# EAGLE design EventCounter (EAGLE 9.0.1)
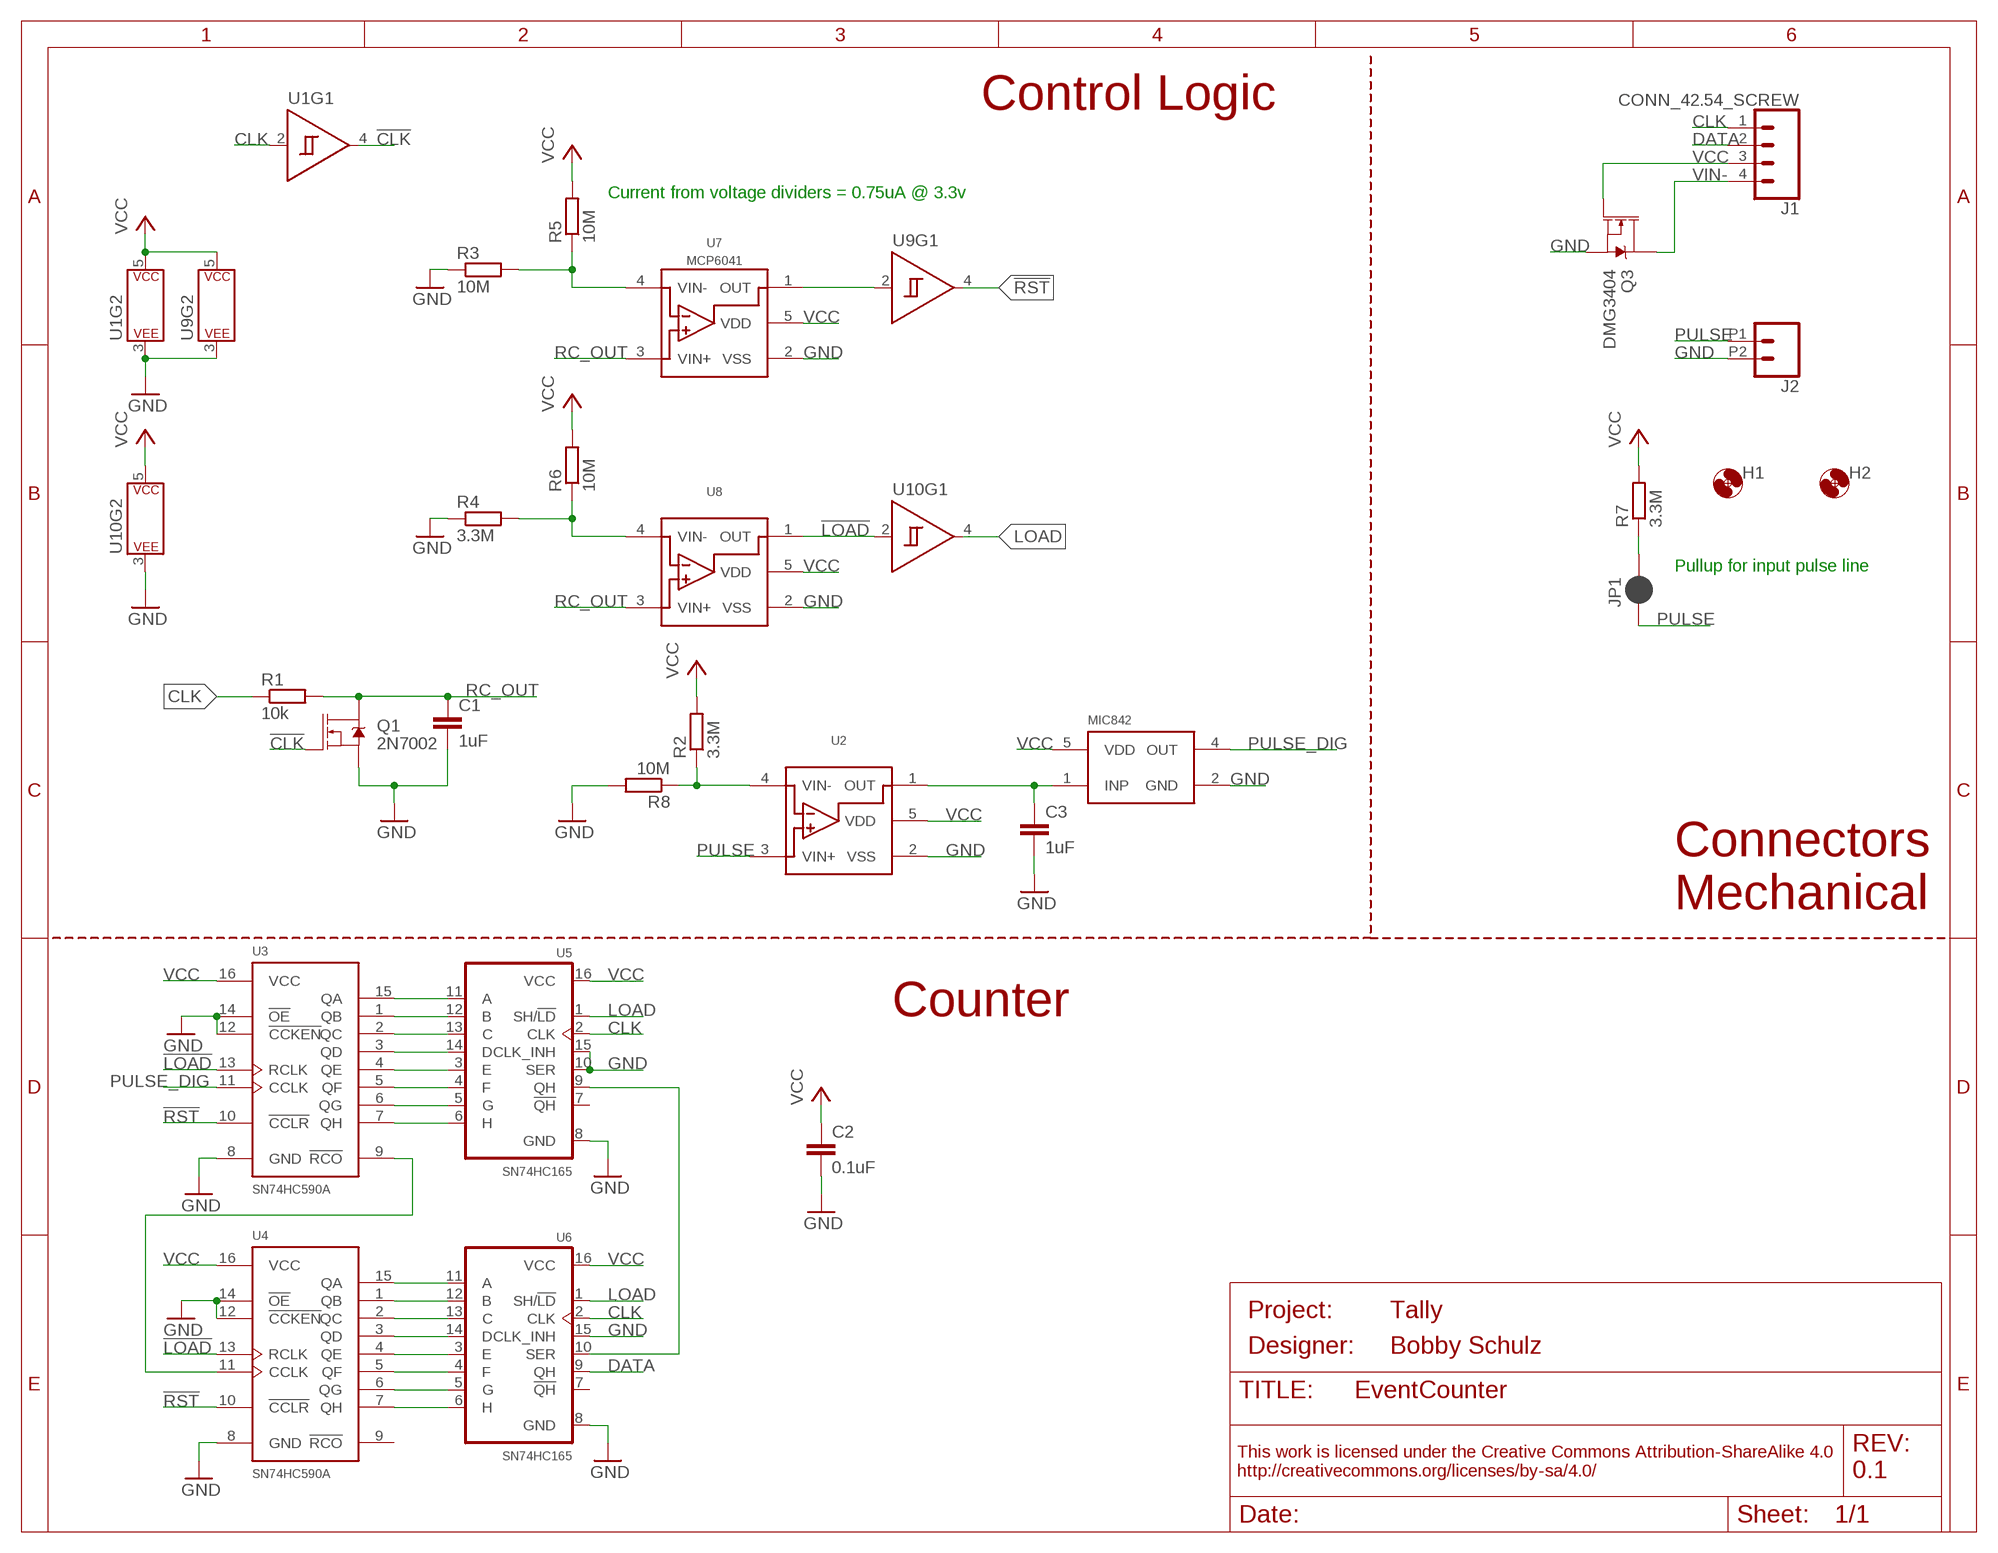
[diagram p0: schematic, sheet 1]
FRAME1 (FRAME_A_L): DESIGNER: Bobby Schulz; PROJECT: Tally; REV: 0.1

## Parts
C1  1uF  C-EU1UFC0603  [C0603]
C2  0.1uF  C-EU0.1UFC0603  [C0603]
C3  1uF  C-EU1UFC0603  [C0603]
H1  MOUNTING_HOLE2_NP  [2_56]
H2  MOUNTING_HOLE2_NP  [2_56]
J1  CONN_42.54_SCREW  [1X04_SCREW]
J2  CONN_02SCREW_2.54  [1X02_2.54_SCREWTERM]
JP1  JUMPER-SMT_2_NC_PASTE_SILK  [SMT-JUMPER_2_NC_PASTE_SILK]
Q1  2N7002  MOSFET-NCH-2N7002PW  [SOT323]
Q3  DMG3404  MOSFET-NCH-DMG3404L  [SOT23-3]
R1  10k  R-EU_10KR0603  [R0603]
R2  3.3M  R-EU_3.3MR0603  [R0603]
R3  10M  R-EU_10MR0603  [R0603]
R4  3.3M  R-EU_3.3MR0603  [R0603]
R5  10M  R-EU_10MR0603  [R0603]
R6  10M  R-EU_10MR0603  [R0603]
R7  3.3M  R-EU_3.3MR0603  [R0603]
R8  10M  R-EU_10MR0603  [R0603]
U1  SN74LVC1G14DCK  [DCK_R-PDSO-G5]
U2  MCP6041  [SOT23-5]
U3  SN74HC590AD  [SO16]
U4  SN74HC590AD  [SO16]
U5  SN74HC165D  [SO16]
U6  SN74HC165D  [SO16]
U7  MCP6041  [SOT23-5]
U8  MCP6041  [SOT23-5]
U9  SN74LVC1G14DCK  [DCK_R-PDSO-G5]
U10  SN74LVC1G14DCK  [DCK_R-PDSO-G5]
U$1  MIC842H  [DCK_R-PDSO-G5]

## Nets
!CLK: Q1.1(G) U1.4(Y)
!LOAD: U3.13(RCLK) U4.13(RCLK) U8.1(OUT) U10.2(A)
!RST: U3.10(!CCLR) U4.10(!CCLR) U9.4(Y)
CLK: J1.1 R1.1 U1.2(A) U5.2(CLK) U6.2(CLK)
DATA: J1.2 U6.9(QH)
GND: C1.2 C2.2 C3.2 J2.P2 Q1.2(S) Q3.2(S) R3.1 R4.1 R8.2 U1.3(P$V-) U2.2(VSS) U3.8(GND) U3.12(!CCKEN) U3.14(!OE) U4.8(GND) U4.12(!CCKEN) U4.14(!OE) U5.8(GND) U5.10(SER) U5.15(CLK_INH) U6.8(GND) U6.15(CLK_INH) U7.2(VSS) U8.2(VSS) U9.3(P$V-) U10.3(P$V-) U$1.2(GND)
LOAD: U5.1(SH/!LD) U6.1(SH/!LD) U10.4(Y)
N$1: U4.15(QA) U6.11(A)
N$2: U4.1(QB) U6.12(B)
N$3: U4.2(QC) U6.13(C)
N$4: U4.3(QD) U6.14(D)
N$5: U4.4(QE) U6.3(E)
N$6: U4.5(QF) U6.4(F)
N$7: U4.6(QG) U6.5(G)
N$8: U4.7(QH) U6.6(H)
N$9: U3.7(QH) U5.6(H)
N$10: U3.6(QG) U5.5(G)
N$11: U3.5(QF) U5.4(F)
N$12: U3.4(QE) U5.3(E)
N$13: U3.3(QD) U5.14(D)
N$14: U3.2(QC) U5.13(C)
N$15: U3.1(QB) U5.12(B)
N$16: U3.15(QA) U5.11(A)
N$17: U5.9(QH) U6.10(SER)
N$18: U3.9(!RCO) U4.11(CCLK)
N$19: R2.1 R8.1 U2.4(VIN-)
N$20: JP1.2 R7.1
N$23: R4.2 R6.1 U8.4(VIN-)
N$24: C3.1 U2.1(OUT) U$1.1(INP)
N$26: R3.2 R5.1 U7.4(VIN-)
PULSE: J2.P1 JP1.1 U2.3(VIN+)
PULSE_DIG: U3.11(CCLK) U$1.4(OUT)
RC_OUT: C1.1 Q1.3(D) R1.2 U7.3(VIN+) U8.3(VIN+)
RST: U7.1(OUT) U9.2(A)
VCC: C2.1 J1.3 Q3.1(G) R2.2 R5.2 R6.2 R7.2 U1.5(P$V+) U2.5(VDD) U3.16(VCC) U4.16(VCC) U5.16(VCC) U6.16(VCC) U7.5(VDD) U8.5(VDD) U9.5(P$V+) U10.5(P$V+) U$1.5(VDD)
VIN-: J1.4 Q3.3(D)
Unconnected: U4.9(!RCO) U5.7(!QH) U6.7(!QH)

## Notes on the sheet
- Control Logic
- Current from voltage dividers = 0.75uA @ 3.3v
- Pullup for input pulse line
- Connectors
  Mechanical
- Counter

## Library data of the parts
C1 C3 = bschulz_passives:C-EU: CAPACITOR, European symbol; DIGIKEY: 1276-6524-1-ND; MF: Samsung; MPN: 1276-6524-1-ND
C2 = bschulz_passives:C-EU: CAPACITOR, European symbol; DIGIKEY: 490-6051-1-ND; MF: Murata; MPN: GCM188R71E104KA57D
H1 H2 = bschulz:MOUNTING_HOLE: Genaric Mechanical Mounting Hole Hole diameter based on max body diameter + 15% Keepout ring is for diameter of socket cap screw (minimum required clearance) TPlace ring is for diameter of pan head screw (recomended clearance) Specifications: Socket Cap <http://fastener-express.com/fastener-technical/SocketscapSS-Alloy.pdf> Button Head Socket Cap <http://fastener-express.com/fastener-technical/Button-Socket-alloy.pdf> Pan Head <http://fastener-express.com/fastener-technical/pan-machine-Screws.pdf>
J1 = bschulz:CONN_4: Genaric 4 pin connector; DIGIKEY: ED10563-ND; MF: On Shore; MPN: OSTVN04A150
J2 = bschulz:CONN_02: Multi connection point. Often used as Generic Header-pin footprint for 0.1 inch spaced/style header connections On any of the 0.1 inch spaced packages, you can populate with these: Break Away Headers - Straight <https://www.sparkfun.com/products/116> (PRT-00116) Break Away Male Headers - Right Angle <https://www.sparkfun.com/products/553> (PRT-00553) Female Headers <https://www.sparkfun.com/products/115> (PRT-00115) Break Away Headers - Machine Pin <https://www.sparkfun.com/products/117> (PRT-00117) Break Away Female Headers - Swiss Machine Pin <https://www.sparkfun.com/products/743> (PRT-00743) For SCREWTERMINALS and SPRING TERMINALS visit here: Screw Terimnals on SparkFun.com <https://www.sparkfun.com/search/results?term=Screw+Terminals> (5mm/3.5mm/2.54mm spacing) This device is also useful as a general connection point to wire up your design to another part of your project. Our various solder wires solder well into these plated through hole pads. Hook-Up Wire - Assortment (Stranded, 22 AWG) <https://www.sparkfun.com/products/11375> (PRT-11375) Hook-Up Wire - Assortment (Solid Core, 22 AWG) <https://www.sparkfun.com/products/11367> (PRT-11367) View the entire wire category on our website here <https://www.sparkfun.com/categories/141> Special notes: Molex polarized connector foot print use with: PRT-08233 with associated crimp pins and housings. 2.54_SCREWTERM for use with PRT-10571. 3.5mm Screw Terminal footprints for PRT-08084 5mm Screw Terminal footprints for use with PRT-08432; DIGIKEY: ED10561-ND; MF: OnShore; MPN: OSTVN02A150
JP1 = SparkFun-Jumpers:JUMPER-SMT_2_NC_PASTE: Normally closed solder jumper This jumper has an aperture in the stencil to allow solder paste to bridge the split in the wire so it's normally closed (NC). Wick off the solder to open the connection. Reapply solder to reclose the connection.
Q1 = bschulz:MOSFET-NCH: N-channel MOSFETs Voltage controlled devices that allow control of high current outputs. SparkFun Products: SparkFun OpenScale <https://www.sparkfun.com/products/13261> SparkFun Digital Sandbox <https://www.sparkfun.com/products/12651> SparkFun Monster Moto Shield <https://www.sparkfun.com/products/10182> SparkFun MOSFET Power Controller <https://www.sparkfun.com/products/11214>; DIGIKEY: 2N7002W-FDICT-ND; MF: Diodes Incorporated; MPN: 2N7002W-7-F; PROD_ID: TRANS-11151
Q3 = bschulz:MOSFET-NCH: N-channel MOSFETs Voltage controlled devices that allow control of high current outputs. SparkFun Products: SparkFun OpenScale <https://www.sparkfun.com/products/13261> SparkFun Digital Sandbox <https://www.sparkfun.com/products/12651> SparkFun Monster Moto Shield <https://www.sparkfun.com/products/10182> SparkFun MOSFET Power Controller <https://www.sparkfun.com/products/11214>; DIGIKEY: DMG3404L-7DICT-ND; MF: Diodes Incorporated; MPN: DMG3404L-7
R1 = bschulz_passives:R-EU_: RESISTOR, European symbol; DIGIKEY: P10.0KHCT-ND; MF: Panasonic; MPN: ERJ-3EKF1002V; VALUE_PART: 10k
R2 R4 R7 = bschulz_passives:R-EU_: RESISTOR, European symbol; DIGIKEY: RMCF0603FT3M30CT-ND; MF: Stackpole; MPN: RMCF0603FT3M30; VALUE_PART: 3.3M
R3 R5 R6 R8 = bschulz_passives:R-EU_: RESISTOR, European symbol; DIGIKEY: RMCF0603FT10M0CT-ND; MF: Stackpole; MPN: RMCF0603FT10M0; VALUE_PART: 10M
U1 U9 U10 = bschulz:SN74*1G14: SN74x1G14 - Single Schmitt Triger Inverter Characteristics: VCC: 0.8 ~ 3.6V (1.65 ~ 5.5V for LVC Version) Operating Temperature: -40°C to 85°C (-40°C to 125°C for LVC Version) fmax = 2.5 MHz (for Vcc =1.65v, high for higher Vcc) Output Current = ± 4 mA (± 32 mA for LVC Version) Digikey: 296-19076-1-ND (AUP Low Voltage) <https://www.digikey.com/product-detail/en/texas-instruments/SN74AUP1G14DCKR/296-19076-1-ND/864307> 296-47215-1-ND (LVC High Voltage) <https://www.digikey.com/product-detail/en/texas-instruments/SN74LVC1G14DCKR/296-11608-1-ND/385747>; DIGIKEY: 296-11608-1-ND; MF: TI; MPN: SN74LVC1G14DCKR
U2 U7 U8 = bschulz:MCP6041: MCP6041 - Low Power Rail to Rail Op-Amp Characteristics: Vs: 1.4V ~ 6V Iq: 600nA Common Mode Range: 0V ~ 6V GBP: 14 kHz Operating Temperature: -40°C to 125°C Digikey: MCP6041T-I/OTCT-ND <https://www.digikey.com/product-detail/en/microchip-technology/MCP6041T-I-OT/MCP6041T-I-OTCT-ND/529846>; DIGIKEY: MCP6041T-I/OTCT-ND; DISP: MCP6041; MF: Microchip; MPN: MCP6041T-I/OT
U3 U4 = bschulz:SN74HC590A: SN74HC590A - 8 bit binary counter with direct clear Characteristics: VCC: 2~6V Operating Temperature: -40°C to 85°C fmax = 2.5 MHz (for Vcc = 2v, high for higher Vcc) Digikey: 296-8340-5-ND (SOIC) <https://www.digikey.com/product-detail/en/texas-instruments/SN74HC590AD/296-8340-5-ND/376756> 296-1599-5-ND (DIP) <https://www.digikey.com/product-detail/en/texas-instruments/SN74HC590AN/296-1599-5-ND/277245>; DIGIKEY: 296-8340-5-ND; MF: TI; MPN: SN74HC590AD
U5 U6 = bschulz:SN74HC165: SN74HC165 - 8 bit PISO shift register Characteristics: VCC: 2~6V Operating Temperature: -40°C to 85°C fmax = 2.5 MHz (for Vcc = 2v, high for higher Vcc) Digikey: 296-8253-1-ND (TSSOP) <https://www.digikey.com/product-detail/en/texas-instruments/SN74HC165PWR/296-8253-1-ND/376670> 296-8250-1-ND (SOIC) <https://www.digikey.com/product-detail/en/texas-instruments/SN74HC165DR/296-8250-1-ND/405259> 296-8251-5-ND (DIP) <https://www.digikey.com/product-detail/en/texas-instruments/SN74HC165N/296-8251-5-ND/376966>; DIGIKEY: 296-8250-1-ND; MF: TI; MPN: SN74HC165DR
U$1 = bschulz:MIC842: Comparator with internal voltage referance (1.24V), 5V and 3.3V compatable, 20mA output current; DIGIKEY: 576-2926-1-ND; MF: Microchip; MPN: MIC842HYC5-TR

## Board
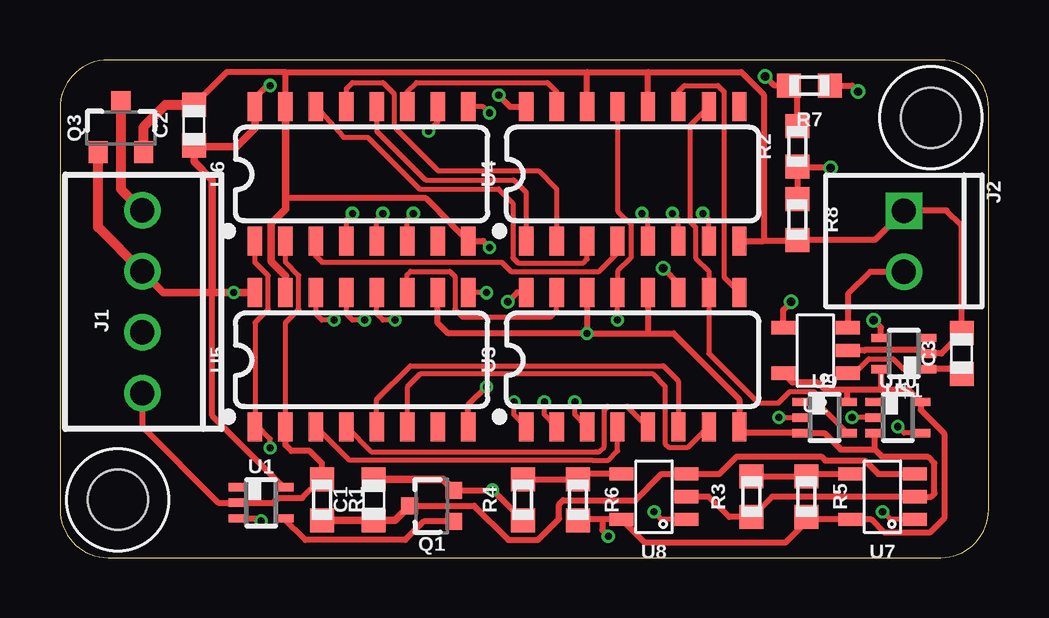
[diagram p1: board, top side]
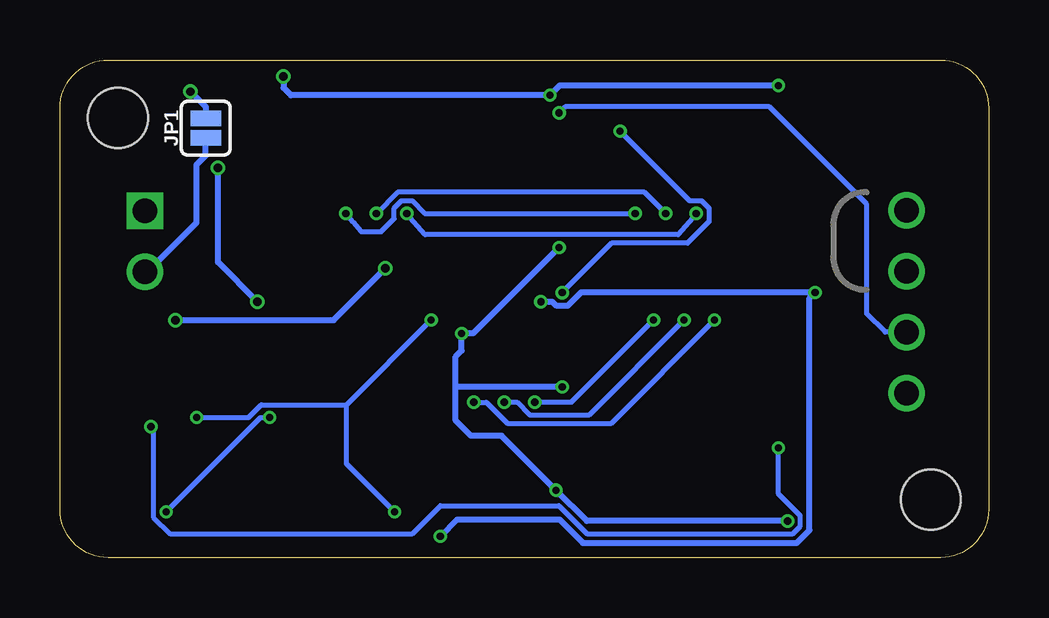
[diagram p2: board, bottom side, seen from below]

Size 38.72 x 20.75 mm. Coordinates in mm from the lower left corner, seen from the top.
Outline: 0,18.75 0,2 arc90 2,0 36.72,0 arc90 38.72,2 38.72,18.75 arc90 36.72,20.75 2,20.75 arc90 0,18.75
Copper layers (1*16): Top 0.035559375mm / dielectric 1.6mm / Bottom 0.035559375mm
Design rules "oshpark-2layer": minimum track width 6mil, minimum drill 10mil, track to track 6mil, track to pad 6mil, pad to pad 6mil, via to via 6mil, smd to smd 6mil, copper to edge 15mil, drill to drill 6mil, minimum pad ring 5mil, minimum via ring 5mil, stop-mask expansion 2.5mil, vias tented up to drill 0mil, thermal gap 10mil

### Footprints (pad centres in the part's own frame; a part is rotated, then mirrored left to right if it is on the bottom)
C0603 = smd 1 x 1: 1 -0.85,0; 2 0.85,0
2_56 = hole 2.5: 0,0
1X04_SCREW = drill 1.016: 1 -3.81,0; 2 -1.27,0; 3 1.27,0; 4 3.81,0
1X02_2.54_SCREWTERM = drill 1.016: P1 1.27,0 | drill 1.016 square: P2 -1.27,0
SMT-JUMPER_2_NC_PASTE_SILK = smd 0.635 x 1.27: 1 -0.406,0; 2 0.406,0
SOT323 = smd 0.7 x 0.7: 1 -0.65,-0.925; 2 0.65,-0.925; 3 0,0.925
SOT23-3 = smd 0.8 x 0.9: 1 -0.95,-1; 2 0.95,-1; 3 0,1.1
R0603 = smd 1 x 1: 1 -0.85,0; 2 0.85,0
DCK_R-PDSO-G5 = smd 0.35 x 0.8: 1 -0.65,-0.95; 2 0,-0.95; 3 0.65,-0.95; 4 0.65,0.95; 5 -0.65,0.95
SOT23-5 = smd 0.55 x 1: 1 -0.95,-1.35; 2 0,-1.35; 3 0.95,-1.35; 4 0.95,1.35; 5 -0.95,1.35
SO16 = smd 0.6 x 1.2: 1 -4.445,-2.8; 2 -3.175,-2.8; 3 -1.905,-2.8; 4 -0.635,-2.8; 5 0.635,-2.8; 6 1.905,-2.8; 7 3.175,-2.8; 8 4.445,-2.8; 9 4.445,2.8; 10 3.175,2.8; 11 1.905,2.8; 12 0.635,2.8; 13 -0.635,2.8; 14 -1.905,2.8; 15 -3.175,2.8; 16 -4.445,2.8

### Placement (x,y rotation side)
C1  13.08,2.41 90 top
C2  5.59,18.03 90 top
C3  37.59,8.51 90 top
H1  2.41,2.41 0 top
H2  36.3,18.34 0 top
J1  3.43,10.67 90 top
J2  35.18,13.19 270 top
JP1  32.64,17.91 90 bottom
Q1  15.49,2.16 90 top
Q3  2.54,17.91 0 top
R1  10.92,2.41 270 top
R2  30.73,17.14 90 top
R3  28.83,2.54 90 top
R4  19.3,2.41 90 top
R5  31.11,2.54 270 top
R6  21.59,2.41 270 top
R7  31.24,19.68 180 top
R8  30.73,14.1 270 top
U1  8.38,2.29 270 top
U2  31.5,8.64 90 top
U3  23.88,8.26 0 top
U4  23.88,16 0 top
U5  12.57,8.26 0 top
U6  12.57,16 0 top
U7  34.29,2.54 90 top
U8  24.77,2.54 90 top
U9  31.88,5.84 270 top
U10  34.92,5.84 270 top
U$1  35.18,8.51 90 top

### Tracks (layer width: path | path; a pad name or v marks a point on that pad's centre or on a via)
!CLK
  Top 0.254: Q1.1 15.16,1.51 14.39,0.73 10.23,0.73 U1.4
!LOAD  (via drill 0.3)
  Top 0.2: U10.2 v33.02,5.84 | v23.24,9.91 U3.13 23.24,11.95 23.79,12.5 23.79,13.91 23.24,14.46 U4.13 | U8.1 25.08,1.59 v24.77,1.91
  Bottom 0.2: v33.02,5.84 30.85,5.84 30.32,6.37 26.78,6.37 | 26.78,6.37 v23.24,9.91 | v24.77,1.91 26.78,3.92 26.78,6.37
!RST
  Top 0.2: U4.10 26.27,18.02 26.27,14.01 26.5,13.77 26.5,12.5 27.05,11.95 U3.10 27.05,8.51 29.12,6.44 29.94,6.44 30.42,6.92 31.43,6.92 31.58,6.77 31.58,6.44 U9.4
CLK
  Top 0.2: U6.2 9.4,12.32 9.95,11.76 9.95,10.35 9.4,9.8 9.4,5.59 U5.2
  Top 0.254: J1.1 3.43,5.46 6.6,2.29 U1.2 8.89,2.29 9.09,2.48 10.1,2.48 10.88,3.26 R1.1 | 10.63,3.26 R1.1 | R1.1 10.92,3.94 10.41,4.45 9.65,4.45 9.4,4.7 9.4,5.59
DATA  (via drill 0.3)
  Top 0.2: v17.91,18.54 17.65,18.8 U6.9
  Bottom 0.2: J1.2 4.32,9.4 5.08,10.16 5.08,14.73 9.14,18.8 17.65,18.8 v17.91,18.54
GND  (via drill 0.3)
  Top 0.254: R4.1 18.06,2.81 v18.03,2.81 Q1.2 | U8.2 27.05,2.54 27.9,1.69 R3.1 29.68,2.54 U7.2 36.32,2.54 36.45,2.67 36.45,3.94 36.2,4.19 34.29,4.19 33.98,4.51 | 33.8,5.19 U10.3 33.98,4.51 | 33.98,4.51 32.54,4.51 31.86,5.19 U9.3 28.58,5.19 U3.8 28.32,6.6 25.57,9.35 24.51,9.35 | 9.4,20.24 21.97,20.24 | U4.14 21.97,20.24 | U6.15 9.4,20.24 | 29.34,13.21 29.34,19.3 28.4,20.24 24.51,20.24 | 21.97,20.24 24.51,20.24 | U4.8 29.34,13.21 | U4.12 24.51,20.24 | U5.10 15.75,9.78 16.18,9.35 v21.97,9.35 | U3.14 v21.97,9.35 | 9.4,14.99 15.26,14.99 16.33,13.92 16.33,13.89 U6.8 17.64,13.2 v17.91,12.93 | U5.8 17.02,6.36 v17.78,7.12 | v21.97,9.35 24.51,9.35 | U3.12 24.51,9.35 | U1.3 8.27,1.64 v8.38,1.52 | C2.2 6.95,20.24 9.4,20.24 | U2.2 33.54,8.64 33.57,8.67 35.97,8.67 U$1.2 36.74,8.51 C3.2 37.59,13.84 36.96,14.48 35.2,14.48 J2.P2 33.97,13.25 R8.2 30.7,13.21 29.34,13.21
  Top 0.305: U5.15 9.4,11.74 8.79,12.35 8.79,13.93 9.4,14.53 9.4,14.99 U6.15 | C1.2 15.96,3.26 Q1.2
  Top 0.406: Q3.2 3.49,17.97 4.41,18.88 C2.2
  Bottom 0.254: v17.91,12.93 21.49,9.35 v21.97,9.35 21.97,8.64 22.23,8.38 22.23,7.11 | v17.78,7.12 22.22,7.12 22.23,7.11 | 22.23,7.11 22.23,5.71 21.59,5.08 20.3,5.08 v18.03,2.81 16.75,1.52 v8.38,1.52
LOAD  (via drill 0.3)
  Top 0.2: U6.1 8.13,12.31 8.68,11.76 8.68,10.35 8.13,9.8 8.13,5.59 | 8.13,5.59 U5.1 | U10.4 35.19,5.19 v34.92,5.46 | v8.76,4.57 8.76,4.95 8.13,5.59
  Bottom 0.2: v34.92,5.46 34.82,5.36 34.82,1.69 34.13,0.99 24.02,0.99 22.86,2.16 17.92,2.16 16.76,0.99 8.16,0.99 7.85,1.3 7.85,1.74 8.76,2.65 v8.76,4.57
N$1
  Top 0.2: U4.15 20.7,18.68 20.7,19.43 20.32,19.81 14.86,19.81 14.48,19.43 U6.11
N$2
  Top 0.2: U6.12 13.21,17.78 15.24,15.75 18.92,15.75 19.43,15.24 U4.1
N$3
  Top 0.2: U6.13 11.94,19.56 12.19,19.81 13.46,19.81 13.93,19.35 13.93,17.97 15.77,16.13 19.94,16.13 20.7,15.37 U4.2
N$4
  Top 0.2: U6.14 11.82,17.53 12.83,17.53 14.99,15.37 18.29,15.37 18.88,14.78 18.88,12.5 19.09,12.29 21.82,12.29 21.97,12.45 U4.3
N$5
  Top 0.2: U4.4 23.24,12.7 22.48,11.94 18.8,11.94 18.41,12.32 10.92,12.32 10.67,12.57 U6.3
N$6  (via drill 0.3)
  Top 0.2: U6.4 11.94,14.1 v12.19,14.35 | U4.5 24.51,14.1 v24.26,14.35
  Bottom 0.2: v12.19,14.35 12.95,13.46 23.5,13.46 v24.26,14.35
N$7  (via drill 0.3)
  Top 0.2: U6.5 13.21,14.1 v13.46,14.35 | U4.6 25.78,14.1 v25.53,14.35
  Bottom 0.2: v13.46,14.35 14.35,15.24 24.64,15.24 v25.53,14.35
N$8  (via drill 0.3)
  Top 0.2: U6.6 14.48,14.1 v14.73,14.35 | U4.7 27.05,14.1 v26.8,14.35
  Bottom 0.2: v26.8,14.35 26.5,13.99 26.16,13.59 25.33,13.59 24.79,14.13 24.79,14.57 24.48,14.88 24.04,14.88 23.51,14.35 v14.73,14.35
N$9
  Top 0.2: U3.7 27.04,5.46 26.19,4.6 25.38,4.6 25.23,4.75 25.23,7.16 24.74,7.65 15.02,7.65 14.48,7.11 U5.6
N$10
  Top 0.2: U3.6 25.78,7.37 25.15,8 14.61,8 13.21,6.6 U5.5
N$11
  Top 0.2: U5.4 12.97,4.42 22.34,4.42 22.48,4.42 22.69,4.63 22.69,6.16 22.84,6.31 23.65,6.31 24.5,5.46 U3.5
N$12
  Top 0.2: U5.3 12.06,4.07 22.2,4.07 22.2,4.06 22.86,4.06 23.24,4.45 U3.4
N$13  (via drill 0.3)
  Top 0.2: U3.3 21.46,5.96 v21.46,6.48 | v11.43,9.91 10.92,9.91 10.67,10.16 U5.14
  Bottom 0.2: v21.46,6.48 20.93,6.48 20.06,5.6 15.73,5.6 v11.43,9.91
N$14  (via drill 0.3)
  Top 0.2: U3.2 20.19,5.96 v20.19,6.48 | v12.7,9.91 12.19,9.91 11.94,10.16 U5.13
  Bottom 0.2: v20.19,6.48 19.67,6.48 19.14,5.96 16.65,5.96 v12.7,9.91
N$15  (via drill 0.3)
  Top 0.2: U3.1 18.92,5.96 v18.92,6.48 | v13.97,9.91 13.46,9.91 13.21,10.16 U5.12
  Bottom 0.2: v18.92,6.48 17.39,6.48 v13.97,9.91
N$16
  Top 0.2: U3.15 20.7,10.29 20.45,10.03 16.78,10.03 16.47,10.35 16.47,11.73 16.26,11.94 14.61,11.94 14.48,11.81 U5.11
N$17  (via drill 0.3)
  Top 0.2: U6.10 15.75,18.16 v15.37,17.78 | v17.78,11.05 v17.77,11.05 U5.9
  Bottom 0.2: v17.78,11.05 15.72,13.11 12.56,13.11 11.66,14.01 11.66,14.57 11.97,14.88 12.47,14.88 v15.37,17.78
N$18
  Top 0.2: U4.11 25.78,19.43 26.04,19.68 27.43,19.68 27.69,19.43 27.69,11.69 U3.9
N$19  (via drill 0.35)
  Top 0.254: R8.1 R2.1 30.77,16.26 v32.13,16.26 | U2.4 30.15,10.33 v30.48,10.67
  Bottom 0.254: v30.48,10.67 32.13,12.32 v32.13,16.26
N$20  (via drill 0.35)
  Top 0.254: R7.1 33.02,19.68 v33.27,19.43
  Bottom 0.254: v33.27,19.43 32.64,18.8 JP1.2
N$23
  Top 0.254: R4.2 R6.1 21.82,3.49 U8.4
N$24
  Top 0.2: U2.1 33.12,7.69 33.72,8.29 34.73,8.29 35.16,7.86 U$1.1
  Top 0.254: C3.1 37.39,7.86 U$1.1
N$26
  Top 0.254: R3.2 R5.1 31.21,3.49 U7.4
PULSE
  Top 0.254: J2.P1 33.76,11.92 32.85,11 U2.3
  Bottom 0.254: J2.P1 35.07,11.92 33.02,13.97 33.02,16.38 32.64,16.76 JP1.1
PULSE_DIG  (via drill 0.35)
  Top 0.254: U$1.4 34.23,9.59 v33.91,9.91 | v25.15,12.06 25.78,11.43 U3.11
  Bottom 0.254: v33.91,9.91 27.3,9.91 v25.15,12.06
RC_OUT
  Top 0.254: Q1.3 17.26,2.16 18.69,0.73 19.92,0.73 20.81,1.62 20.81,2.23 20.97,2.39 23.98,2.39 25.08,3.49 U8.3 27.48,3.49 28.21,4.22 31.73,4.22 31.91,4.04 33.56,4.04 34.11,3.49 U7.3
  Top 0.305: R1.2 C1.1 13.97,1.56 Q1.3
RST  (via drill 0.3)
  Top 0.2: U7.1 34.6,1.59 v34.29,1.91 | v29.97,5.84 U9.2
  Bottom 0.2: v34.29,1.91 30.35,5.84 v29.97,5.84
VCC  (via drill 0.3, 0.35)
  Top 0.254: U1.5 6.35,5.92 6.35,11.05 | R6.2 21.62,1.59 22.61,1.59 | 31.21,1.59 U7.5 33.82,1.59 34.37,1.04 36.26,1.04 36.85,1.64 36.85,5.18 35.88,6.16 U10.5 35.38,6.99 34.23,6.99 | 31.21,1.59 R5.2 | U6.16 8.13,19.18 8.64,19.68 v8.76,19.68 | v18.29,19.28 18.77,18.8 U4.16 | v18.67,10.67 19.06,11.05 U3.16 | 31.21,1.59 30.26,0.64 24.37,0.64 U8.5 22.61,1.59 | 22.61,1.59 22.61,1.14 v22.86,0.89 | U2.5 30.53,7.3 31.59,7.3 31.9,6.99 32.83,6.99 | 34.23,6.99 32.83,6.99 | U9.5 32.83,6.99 | U$1.5 34.23,6.99 | R2.2 30.73,19.34 R7.2 29.78,19.68 v29.39,20.07
  Top 0.305: J1.3 4.31,11.05 6.35,11.05 | 6.35,11.05 v7.24,11.05 U5.16 | 6.35,11.05 6.35,15.75 5.59,16.51 5.59,17.14 | 5.59,17.14 C2.1 | U6.16 8.13,17.91 7.37,17.14 5.59,17.14
  Top 0.406: J1.3 1.59,13.78 Q3.1
  Bottom 0.254: v8.76,19.68 17.89,19.68 v18.29,19.28 29.08,19.28 29.39,19.59 v29.39,20.07 | v18.67,10.67 18.19,10.67 18.01,10.49 17.55,10.49 16.99,11.05 v7.24,11.05 7.47,10.82 7.47,1.15 8.01,0.61 16.91,0.61 17.89,1.59 22.16,1.59 v22.86,0.89
VIN-
  Top 0.406: Q3.3 2.54,15.37 J1.4

### Text on the board
tDocu: J0
bDocu: To Logger / 3.3v ~ 5v | Project Tally v0.1 / -------------- / Developed by / Northern Widget and / University of Minnesota | GND | GND | ± | Vcc | Pulse | Data | To Sensor / 0v ~ Vcc | Clk